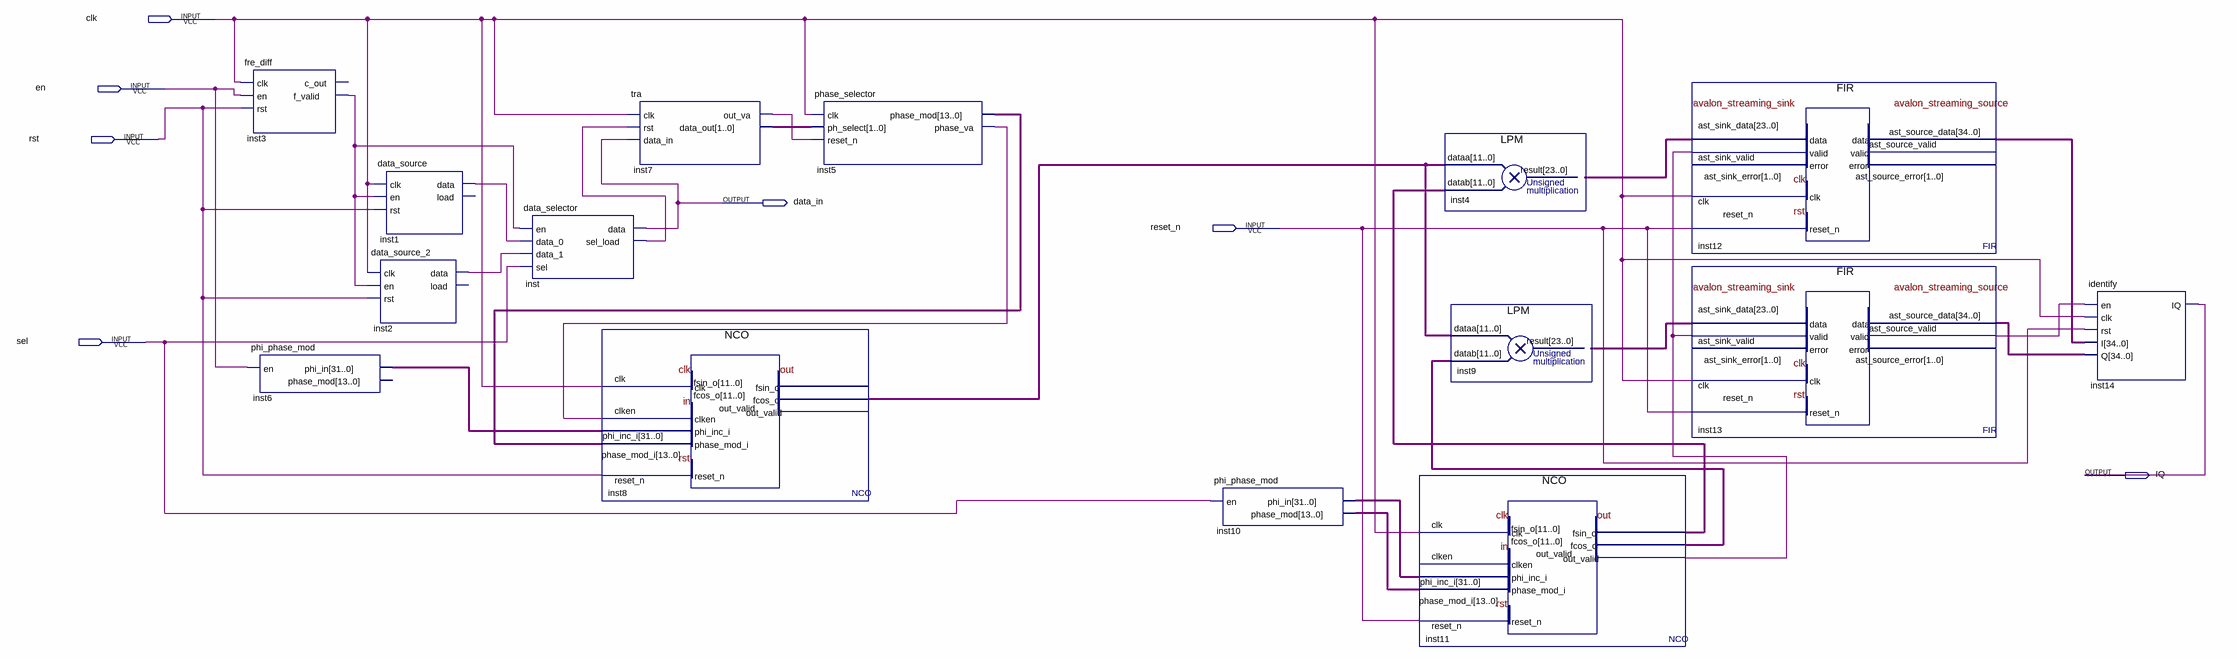
[diagram p0: schematic sheet]
// Quartus schematic QPSKcode+decode.bdf as structural Verilog: 15 symbols, 7 pins
module \QPSKcode+decode  (
  input  clk,
  input  en,
  input  rst,
  input  reset_n,
  input  sel,
  output data_in,
  output IQ
);

  wire inst1_data, inst2_data, inst3_f_valid, inst5_phase_va, inst7_out_va, inst11_out_valid,
       inst13_ast_source_valid, inst_sel_load;
  wire [1:0] inst7_data_out;
  wire [11:0] inst8_fcos_o, inst11_fcos_o, inst11_fsin_o;
  wire [13:0] inst5_phase_mod, inst10_phase_mod;
  wire [23:0] inst4_result, inst9_result;
  wire [31:0] inst6_phi_in, inst10_phi_in;
  wire [34:0] inst12_ast_source_data, inst13_ast_source_data;

  fre_diff inst3 (.clk(clk), .en(en), .rst(rst), .f_valid(inst3_f_valid));  // open: c_out
  phi_phase_mod inst6 (.en(en), .phi_in(inst6_phi_in));  // open: phase_mod
  data_source inst1 (.clk(clk), .en(inst3_f_valid), .rst(rst), .data(inst1_data));  // open: load
  data_source_2 inst2 (.clk(clk), .en(inst3_f_valid), .rst(rst), .data(inst2_data));  // open: load
  data_selector inst (
    .en(inst3_f_valid), .data_0(inst1_data), .data_1(inst2_data), .sel(sel), .data(data_in),
    .sel_load(inst_sel_load));
  tra inst7 (.clk(clk), .rst(inst_sel_load), .data_in(data_in), .out_va(inst7_out_va), .data_out(inst7_data_out));
  NCO inst8 (
    .clk(clk), .clken(inst5_phase_va), .phi_inc_i(inst6_phi_in), .phase_mod_i(inst5_phase_mod),
    .reset_n(rst), .fcos_o(inst8_fcos_o));  // open: fsin_o, out_valid
  phase_selector inst5 (
    .clk(clk), .ph_select(inst7_data_out), .reset_n(inst7_out_va), .phase_mod(inst5_phase_mod),
    .phase_va(inst5_phase_va));
  phi_phase_mod inst10 (.en(sel), .phi_in(inst10_phi_in), .phase_mod(inst10_phase_mod));
  LPM inst4 (.dataa(inst8_fcos_o), .datab(inst11_fsin_o), .result(inst4_result));
  LPM inst9 (.dataa(inst8_fcos_o), .datab(inst11_fcos_o), .result(inst9_result));
  NCO inst11 (
    .clk(clk), .phi_inc_i(inst10_phi_in), .phase_mod_i(inst10_phase_mod), .reset_n(reset_n),
    .fsin_o(inst11_fsin_o), .fcos_o(inst11_fcos_o), .out_valid(inst11_out_valid));  // open: clken
  FIR inst12 (
    .ast_sink_data(inst4_result), .ast_sink_valid(inst11_out_valid), .clk(clk), .reset_n(reset_n),
    .ast_source_data(inst12_ast_source_data));  // open: ast_sink_error, ast_source_valid, ast_source_error
  FIR inst13 (
    .ast_sink_data(inst9_result), .ast_sink_valid(inst11_out_valid), .clk(clk), .reset_n(reset_n),
    .ast_source_data(inst13_ast_source_data), .ast_source_valid(inst13_ast_source_valid));  // open: ast_sink_error, ast_source_error
  identify inst14 (
    .en(inst13_ast_source_valid), .clk(clk), .rst(reset_n), .I(inst12_ast_source_data),
    .Q(inst13_ast_source_data), .IQ(IQ));
endmodule
